# Altium schematic sheet 2N7002.schdoc
size 57 x 40 mm
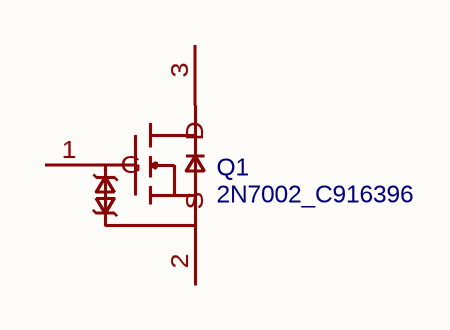
[diagram p0: 2N7002.schdoc]

## Parts
Q1  2N7002_C916396  [SOT-23-3_L2.9-W1.3-P1.90-LS2.4-BR]

## Nets

Not connected (* = marked no-connect by the designer): Q1 1(G) 2(S) 3(D)

## Library data of the parts
Q1 = 2N7002_C916396: BOM_Manufacturer: JSMSEMI(杰盛微); BOM_Manufacturer Part: 2N7002; Contributor: LCSC; BOM_Supplier: LCSC; BOM_Supplier Part: C916396; BOM_JLCPCB Part Class: Extended Part; spicePre: Q; spiceSymbolName: 2N7002_C916396